# Altium schematic sheet mixer.SchDoc: AD630 Mixer
size A4; Organization: Altium Limited; Address1: L3, 12a Rodborough Rd; Address2: Frenchs Forest; Address3: NSW; Address4: Australia 2086
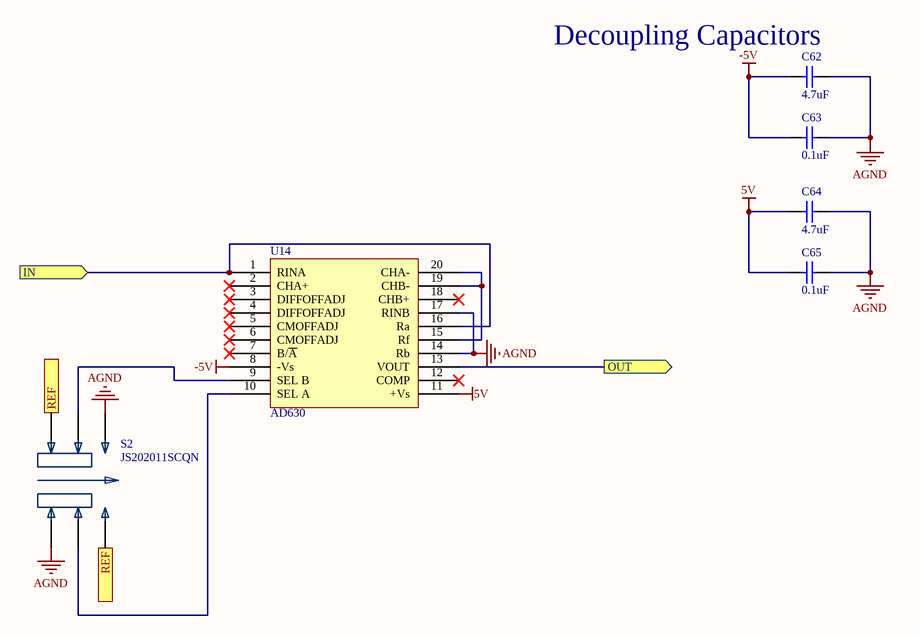
[diagram p0: mixer.SchDoc]

## Parts
C62  4.7uF  [0402_Cap]
C63  0.1uF  [0402_Cap]
C64  4.7uF  [0402_Cap]
C65  0.1uF  [0402_Cap]
S2  JS202011SCQN  [SW_JS202011SCQN]
U14  AD630  [SOIC_20]

## Ports
IN (in), OUT (out), REF (in)

## Nets
5V: C64.1 C65.1 U14.11(+Vs)
-5V: C62.1 C63.1 U14.8(-Vs)
AGND: C62.2 C63.2 C64.2 C65.2 S2.1 S2.6 U14.14(Rb) U14.17(RINB)
IN: U14.1(RINA) U14.16(Ra) ; port IN
OUT: U14.13(VOUT) ; port OUT
REF: S2.3 S2.4 ; port REF
NetS2_2: S2.2 U14.10(SEL_A)
NetS2_5: S2.5 U14.9(SEL_B)
NetU14_15: U14.15(Rf) U14.19(CHB-) U14.20(CHA-)

Not connected (* = marked no-connect by the designer): U14 2(CHA+)* 3(DIFFOFFADJ)* 4(DIFFOFFADJ)* 5(CMOFFADJ)* 6(CMOFFADJ)* 7(B/~{A})* 12(COMP)* 18(CHB+)*

## Notes on the sheet
- (near C62) Decoupling Capacitors
- Title
- Date:
- RE:
- Arturo di Girolamo
- Size:
- A3
- A

## Library data of the parts
C62 C64 = CL21A475KAQNNNE: Capacitor, 4.7uF, 0805; Value: .01uf; ASYPN: GRM155R61A475MEAAD; MFGPN: CL21A475KAQNNNE
C63 C65 = CL21B104KACNNNC: Capacitor, 0.1uF, 0805; Value: .01uf; ASYPN: 0402YC104KAT2A; MFGPN: CL21B104KACNNNC
S2 = JS202011SCQN: Slide Switch DPDT Surface Mount; MF: C&K; MFGPN: JS202011SCQN; Value: *; Package: None; SnapEDA_Link: https://www.snapeda.com/parts/JS202011SCQN/C%26K/view-part/592122/?ref=snap; Digi-Key_Part_Number: 401-2002-1-ND; Digi-Key_Purchase_URL: https://www.digikey.com/product-detail/en/c-k/JS202011SCQN/401-2002-1-ND/1640098?utm_source=snapeda&utm_medium=aggregator&utm_campaign=symbol; ASYPN: JS202011SCQN
U14 = AD630ARZ: RF MOD/DEMOD; ASYPN: AD630ARZ